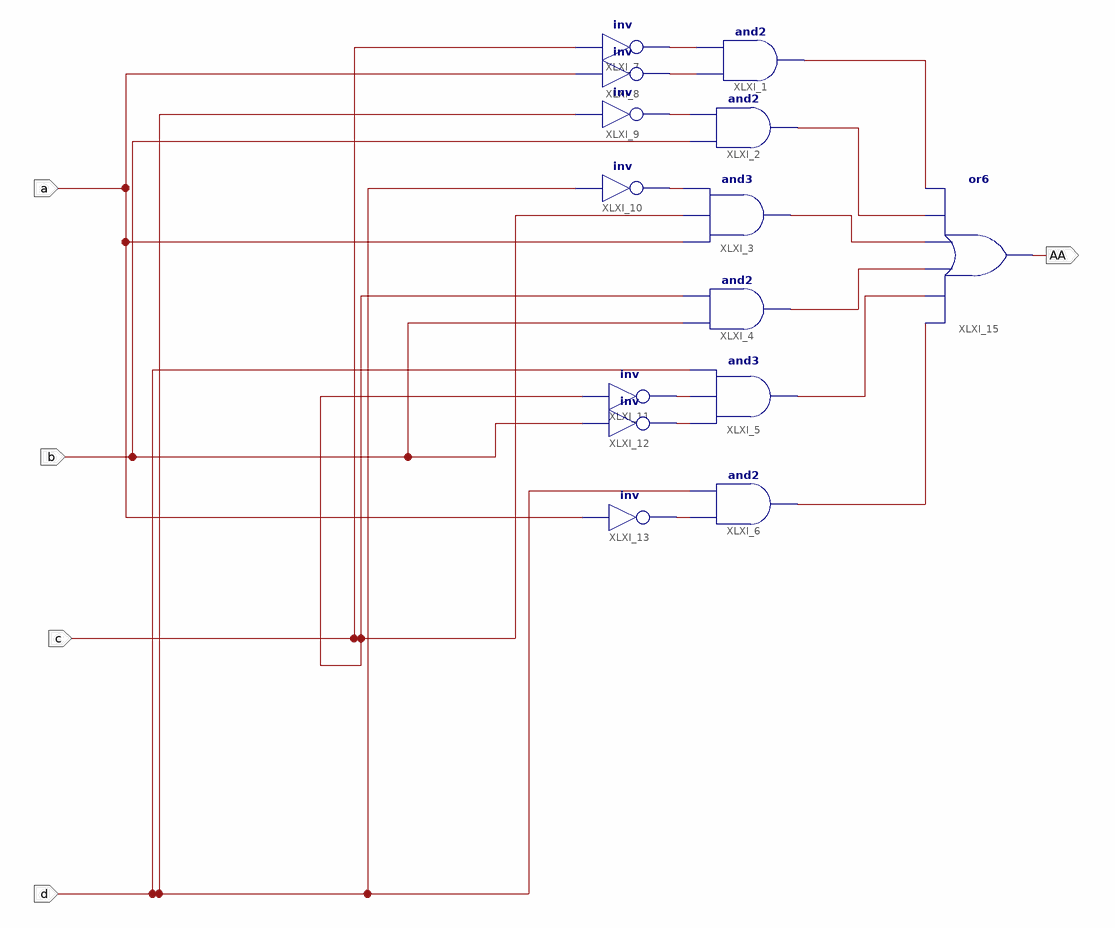
[diagram p0: schematic sheet 1]
// Xilinx ISE schematic hexA.sch (spartan6) as structural Verilog: 14 symbols, 5 ports
module hexA (
  input  a,
  input  b,
  input  c,
  input  d,
  output AA
);

  wire XLXN_9, XLXN_10, XLXN_11, XLXN_12, XLXN_13, XLXN_14, XLXN_15, XLXN_23, XLXN_25, XLXN_26, XLXN_27,
       XLXN_28, XLXN_29;

  and XLXI_1 (XLXN_23, XLXN_10, XLXN_9);
  and XLXI_2 (XLXN_25, b, XLXN_11);
  and XLXI_3 (XLXN_26, a, c, XLXN_12);
  and XLXI_4 (XLXN_27, b, c);
  and XLXI_5 (XLXN_28, XLXN_14, XLXN_13, d);
  and XLXI_6 (XLXN_29, XLXN_15, d);
  not XLXI_7 (XLXN_9, c);
  not XLXI_8 (XLXN_10, a);
  not XLXI_9 (XLXN_11, d);
  not XLXI_10 (XLXN_12, d);
  not XLXI_11 (XLXN_13, c);
  not XLXI_12 (XLXN_14, b);
  not XLXI_13 (XLXN_15, a);
  or XLXI_15 (AA, XLXN_29, XLXN_28, XLXN_27, XLXN_26, XLXN_25, XLXN_23);
endmodule
